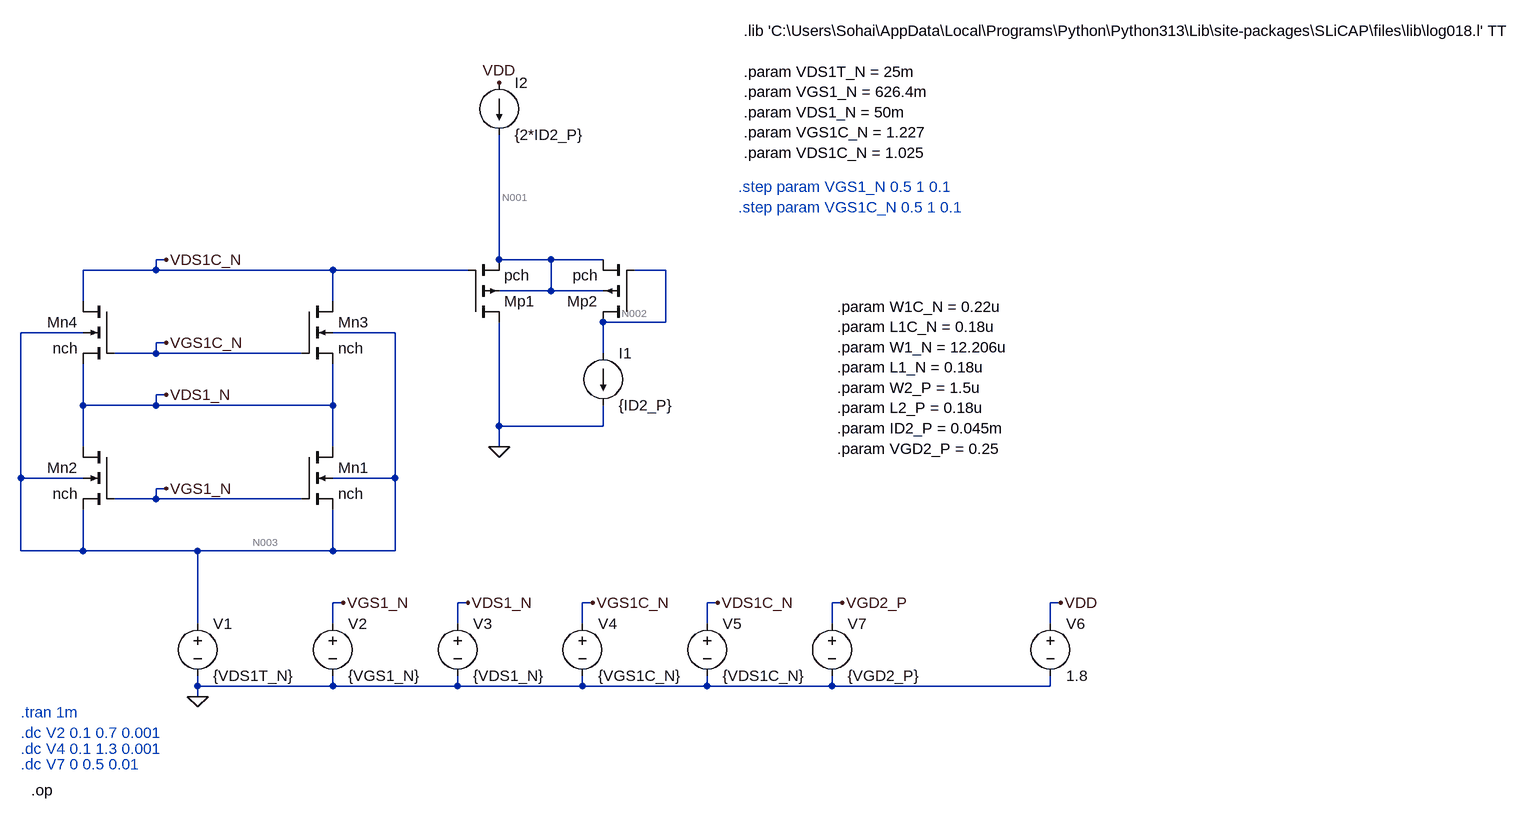
[diagram p0: schematic Draft1 - Copy.asc]
Draft1 - Copy.asc, the LTspice schematic file:
Version 4
SHEET 1 2348 736
WIRE 112 -128 96 -128
WIRE 624 -128 624 -320
WIRE 704 -128 624 -128
WIRE 784 -128 704 -128
WIRE 96 -112 96 -128
WIRE 96 -112 -16 -112
WIRE 368 -112 96 -112
WIRE 576 -112 368 -112
WIRE 880 -112 832 -112
WIRE 704 -80 704 -128
WIRE 704 -80 624 -80
WIRE 784 -80 704 -80
WIRE -16 -64 -16 -112
WIRE 368 -64 368 -112
WIRE 880 -32 880 -112
WIRE 880 -32 784 -32
WIRE -16 -16 -112 -16
WIRE 464 -16 368 -16
WIRE 112 0 96 0
WIRE 96 16 96 0
WIRE 96 16 32 16
WIRE 320 16 96 16
WIRE 784 16 784 -32
WIRE 112 80 96 80
WIRE -16 96 -16 32
WIRE 96 96 96 80
WIRE 96 96 -16 96
WIRE 368 96 368 32
WIRE 368 96 96 96
WIRE 624 128 624 -32
WIRE 784 128 784 96
WIRE 784 128 624 128
WIRE -16 160 -16 96
WIRE 368 160 368 96
WIRE 624 160 624 128
WIRE -112 208 -112 -16
WIRE -16 208 -112 208
WIRE 464 208 464 -16
WIRE 464 208 368 208
WIRE 112 224 96 224
WIRE 96 240 96 224
WIRE 96 240 32 240
WIRE 320 240 96 240
WIRE -112 320 -112 208
WIRE -16 320 -16 256
WIRE -16 320 -112 320
WIRE 160 320 -16 320
WIRE 368 320 368 256
WIRE 368 320 160 320
WIRE 464 320 464 208
WIRE 464 320 368 320
WIRE 384 400 368 400
WIRE 576 400 560 400
WIRE 768 400 752 400
WIRE 960 400 944 400
WIRE 1152 400 1136 400
WIRE 1488 400 1472 400
WIRE 160 432 160 320
WIRE 368 432 368 400
WIRE 560 432 560 400
WIRE 752 432 752 400
WIRE 944 432 944 400
WIRE 1136 432 1136 400
WIRE 1472 432 1472 400
WIRE 160 528 160 512
WIRE 368 528 368 512
WIRE 368 528 160 528
WIRE 560 528 560 512
WIRE 560 528 368 528
WIRE 752 528 752 512
WIRE 752 528 560 528
WIRE 944 528 944 512
WIRE 944 528 752 528
WIRE 1136 528 1136 512
WIRE 1136 528 944 528
WIRE 1472 528 1472 512
WIRE 1472 528 1136 528
WIRE 160 544 160 528
FLAG 112 224 VGS1_N
FLAG 112 0 VGS1C_N
FLAG 160 544 0
FLAG 112 80 VDS1_N
FLAG 112 -128 VDS1C_N
FLAG 384 400 VGS1_N
FLAG 576 400 VDS1_N
FLAG 768 400 VGS1C_N
FLAG 960 400 VDS1C_N
FLAG 624 -400 VDD
FLAG 1488 400 VDD
FLAG 624 160 0
FLAG 1152 400 VGD2_P
DATAFLAG 240 -112 ""
DATAFLAG 240 16 ""
DATAFLAG 256 96 ""
DATAFLAG 240 240 ""
DATAFLAG 672 -128 ""
DATAFLAG 544 -112 ""
DATAFLAG 672 -128 ""
DATAFLAG 880 -96 ""
SYMBOL nmos4 320 160 R0
SYMATTR InstName Mn1
SYMATTR Value nch
SYMATTR Value2 l={L1_N} w={W1_N}
SYMBOL nmos4 32 160 M0
SYMATTR InstName Mn2
SYMATTR Value nch
SYMATTR Value2 l={L1_N} w={W1_N}
SYMBOL nmos4 320 -64 R0
SYMATTR InstName Mn3
SYMATTR Value nch
SYMATTR Value2 l={L1C_N} w={W1C_N}
SYMBOL nmos4 32 -64 M0
SYMATTR InstName Mn4
SYMATTR Value nch
SYMATTR Value2 l={L1C_N} w={W1C_N}
SYMBOL voltage 160 416 R0
WINDOW 123 0 0 Left 0
WINDOW 39 0 0 Left 0
SYMATTR InstName V1
SYMATTR Value {VDS1T_N}
SYMBOL voltage 368 416 R0
WINDOW 123 0 0 Left 0
WINDOW 39 0 0 Left 0
SYMATTR InstName V2
SYMATTR Value {VGS1_N}
SYMBOL voltage 560 416 R0
WINDOW 123 0 0 Left 0
WINDOW 39 0 0 Left 0
SYMATTR InstName V3
SYMATTR Value {VDS1_N}
SYMBOL voltage 752 416 R0
WINDOW 123 0 0 Left 0
WINDOW 39 0 0 Left 0
SYMATTR InstName V4
SYMATTR Value {VGS1C_N}
SYMBOL voltage 944 416 R0
WINDOW 123 0 0 Left 0
WINDOW 39 0 0 Left 0
SYMATTR InstName V5
SYMATTR Value {VDS1C_N}
SYMBOL pmos4 576 -32 M180
SYMATTR InstName Mp1
SYMATTR Value pch
SYMATTR Value2 l={L2_P} w={W2_P}
SYMBOL voltage 1472 416 R0
WINDOW 123 0 0 Left 0
WINDOW 39 0 0 Left 0
SYMATTR InstName V6
SYMATTR Value 1.8
SYMBOL current 624 -400 R0
WINDOW 123 0 0 Left 0
WINDOW 39 0 0 Left 0
SYMATTR InstName I2
SYMATTR Value {2*ID2_P}
SYMBOL voltage 1136 416 R0
WINDOW 123 0 0 Left 0
WINDOW 39 0 0 Left 0
SYMATTR InstName V7
SYMATTR Value {VGD2_P}
SYMBOL pmos4 832 -32 R180
SYMATTR InstName Mp2
SYMATTR Value pch
SYMATTR Value2 l={L2_P} w={W2_P}
SYMBOL current 784 16 R0
WINDOW 123 0 0 Left 0
WINDOW 39 0 0 Left 0
SYMATTR InstName I1
SYMATTR Value {ID2_P}
TEXT 1000 -480 Left 2 !.lib 'C:\\Users\\Sohai\\AppData\\Local\\Programs\\Python\\Python313\\Lib\\site-packages\\SLiCAP\\files\\lib\\log018.l' TT\n \n.param VDS1T_N = 25m\n.param VGS1_N = 626.4m\n.param VDS1_N = 50m\n.param VGS1C_N = 1.227\n.param VDS1C_N = 1.025
TEXT 1144 -56 Left 2 !.param W1C_N = 0.22u\n.param L1C_N = 0.18u\n.param W1_N = 12.206u\n.param L1_N = 0.18u\n.param W2_P = 1.5u\n.param L2_P = 0.18u\n.param ID2_P = 0.045m\n.param VGD2_P = 0.25
TEXT -112 568 Left 2 ;.tran 1m
TEXT -112 600 Left 2 ;.dc V2 0.1 0.7 0.001
TEXT 992 -240 Left 2 ;.step param VGS1_N 0.5 1 0.1\n.step param VGS1C_N 0.5 1 0.1
TEXT -112 624 Left 2 ;.dc V4 0.1 1.3 0.001
TEXT -96 688 Left 2 !.op
TEXT -112 648 Left 2 ;.dc V7 0 0.5 0.01

The netlist it stands for:
* Draft1 - Copy.asc
Mn1 VDS1_N VGS1_N N003 N003 nch l={L1_N} w={W1_N}
Mn2 VDS1_N VGS1_N N003 N003 nch l={L1_N} w={W1_N}
Mn3 VDS1C_N VGS1C_N VDS1_N N003 nch l={L1C_N} w={W1C_N}
Mn4 VDS1C_N VGS1C_N VDS1_N N003 nch l={L1C_N} w={W1C_N}
V1 N003 0 {VDS1T_N}
V2 VGS1_N 0 {VGS1_N}
V3 VDS1_N 0 {VDS1_N}
V4 VGS1C_N 0 {VGS1C_N}
V5 VDS1C_N 0 {VDS1C_N}
Mp1 0 VDS1C_N N001 N001 pch l={L2_P} w={W2_P}
V6 VDD 0 1.8
I2 VDD N001 {2*ID2_P}
V7 VGD2_P 0 {VGD2_P}
Mp2 N002 N002 N001 N001 pch l={L2_P} w={W2_P}
I1 N002 0 {ID2_P}
.model NMOS NMOS
.model PMOS PMOS
.lib standard.mos
.lib 'C:\Users\Sohai\AppData\Local\Programs\Python\Python313\Lib\site-packages\SLiCAP\files\lib\log018.l' TT
.param VDS1T_N = 25m
.param VGS1_N = 626.4m
.param VDS1_N = 50m
.param VGS1C_N = 1.227
.param VDS1C_N = 1.025
.param W1C_N = 0.22u
.param L1C_N = 0.18u
.param W1_N = 12.206u
.param L1_N = 0.18u
.param W2_P = 1.5u
.param L2_P = 0.18u
.param ID2_P = 0.045m
.param VGD2_P = 0.25
* .tran 1m
* .dc V2 0.1 0.7 0.001
* .step param VGS1_N 0.5 1 0.1
* .step param VGS1C_N 0.5 1 0.1
* .dc V4 0.1 1.3 0.001
.op
* .dc V7 0 0.5 0.01
.backanno
.end

* Results of the author's LTspice run, read from the files saved beside the schematic
* Operating Point:
*   V(vds1_n) = 50 mV
*   V(vgs1_n) = 626.4 mV
*   V(n003) = 25 mV
*   V(vds1c_n) = 1.025 V
*   V(vgs1c_n) = 1.227 V
*   V(n001) = 1.889 V
*   V(vdd) = 1.8 V
*   V(vgd2_p) = 250 mV
*   V(n002) = 999.3 mV
*   Id(Mn1) = 63.88 µA
*   Ig(Mn1) = 0 A
*   Ib(Mn1) = -31.2 fA
*   Is(Mn1) = -63.88 µA
*   Id(Mn2) = 63.88 µA
*   Ig(Mn2) = 0 A
*   Ib(Mn2) = -31.2 fA
*   Is(Mn2) = -63.88 µA
*   Id(Mn3) = 63.84 µA
*   Ig(Mn3) = 0 A
*   Ib(Mn3) = -1.313 pA
*   Is(Mn3) = -63.84 µA
*   Id(Mn4) = 63.84 µA
*   Ig(Mn4) = 0 A
*   Ib(Mn4) = -1.313 pA
*   Is(Mn4) = -63.84 µA
*   Id(Mp1) = -45 µA
*   Ig(Mp1) = 0 A
*   Ib(Mp1) = 341.4 pA
*   Is(Mp1) = 45 µA
*   Id(Mp2) = -45 µA
*   Ig(Mp2) = 0 A
*   Ib(Mp2) = 899.5 fA
*   Is(Mp2) = 45 µA
*   I(I2) = 90 µA
*   I(I1) = 45 µA
*   I(V1) = 127.8 µA
*   I(V2) = 0 A
*   I(V3) = -83.23 nA
*   I(V4) = 0 A
*   I(V5) = -127.7 µA
*   I(V6) = -90 µA
*   I(V7) = 0 A
* From the log:
*   Semiconductor Device Operating Points:
*                           --- BSIM3 MOSFETS ---
*   Name:        mn1         mn2         mn3         mn4         mp1
*   Model:      nch.3       nch.3      nch.12      nch.12       pch.6
*   Id:        6.39e-05    6.39e-05    6.38e-05    6.38e-05   -4.50e-05
*   Vgs:       6.01e-01    6.01e-01    1.18e+00    1.18e+00   -8.64e-01
*   Vds:       2.50e-02    2.50e-02    9.75e-01    9.75e-01   -1.89e+00
*   Vbs:       0.00e+00    0.00e+00   -2.50e-02   -2.50e-02    0.00e+00
*   Vth:       5.11e-01    5.11e-01    5.20e-01    5.20e-01   -4.95e-01
*   Vdsat:     1.06e-01    1.06e-01    3.37e-01    3.37e-01   -2.93e-01
*   Gm:        5.58e-04    5.58e-04    1.13e-04    1.13e-04    2.00e-04
*   Gds:       2.18e-03    2.18e-03    7.07e-06    7.07e-06    3.85e-06
*   Gmb        1.66e-04    1.66e-04    3.15e-05    3.15e-05    6.73e-05
*   Cbd:       0.00e+00    0.00e+00    0.00e+00    0.00e+00    0.00e+00
*   Cbs:       0.00e+00    0.00e+00    0.00e+00    0.00e+00    0.00e+00
*   Cgsov:     4.47e-15    4.47e-15    7.33e-17    7.33e-17    4.82e-16
*   Cgdov:     4.47e-15    4.47e-15    7.33e-17    7.33e-17    4.82e-16
*   Cgbov:     3.18e-17    3.18e-17    3.18e-17    3.18e-17    4.83e-17
*   dQgdVgb:   2.39e-14    2.39e-14    4.11e-16    4.11e-16    2.79e-15
*   dQgdVdb:  -8.13e-15   -8.13e-15   -7.31e-17   -7.31e-17   -4.78e-16
*   dQgdVsb:  -1.41e-14   -1.41e-14   -2.69e-16   -2.69e-16   -2.18e-15
*   dQddVgb:  -9.97e-15   -9.97e-15   -7.39e-17   -7.39e-17   -4.82e-16
*   dQddVdb:   1.51e-14    1.51e-14    7.39e-17    7.39e-17    4.82e-16
*   dQddVsb:  -3.45e-15   -3.45e-15    2.07e-19    2.07e-19    3.43e-19
*   dQbdVgb:  -1.10e-15   -1.10e-15   -6.89e-17   -6.89e-17   -4.20e-16
*   dQbdVdb:  -3.40e-15   -3.40e-15   -3.86e-20   -3.86e-20    5.33e-19
*   dQbdVsb:  -1.19e-15   -1.19e-15   -5.02e-17   -5.02e-17   -1.86e-16
*   Name:        mp2
*   Model:      pch.6
*   Id:       -4.50e-05
*   Vgs:      -8.90e-01
*   Vds:      -8.90e-01
*   Vbs:       0.00e+00
*   Vth:      -4.99e-01
*   Vdsat:    -3.06e-01
*   Gm:        1.89e-04
*   Gds:       7.59e-06
*   Gmb        6.51e-05
*   Cbd:       0.00e+00
*   Cbs:       0.00e+00
*   Cgsov:     4.82e-16
*   Cgdov:     4.82e-16
*   Cgbov:     4.83e-17
*   dQgdVgb:   2.80e-15
*   dQgdVdb:  -4.78e-16
*   dQgdVsb:  -2.19e-15
*   dQddVgb:  -4.84e-16
*   dQddVdb:   4.84e-16
*   dQddVsb:   1.51e-18
*   dQbdVgb:  -4.21e-16
*   dQbdVdb:   6.39e-20
*   dQbdVsb:  -1.84e-16